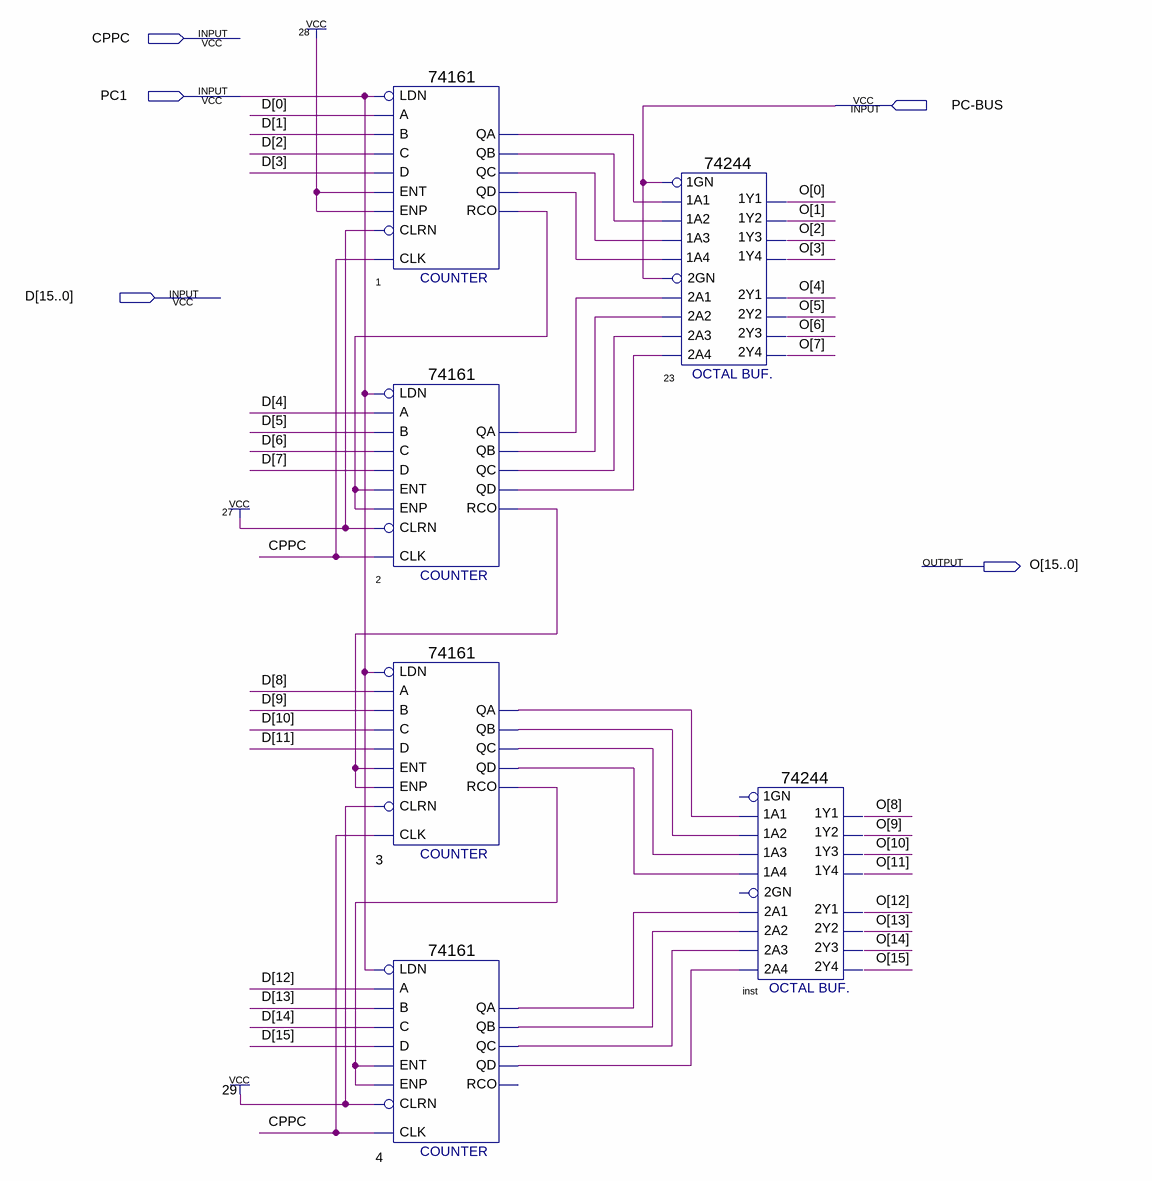
[diagram p0: schematic sheet]
// Quartus schematic 1612.bdf as structural Verilog: 6 symbols, 5 pins
module \1612  (
  input  CPPC,
  input  PC1,
  input  \PC-BUS ,
  input  [15:0] D,
  output [15:0] O
);

  wire n1_qa, n1_qb, n1_qc, n1_qd, n1_rco, n2_qa, n2_qb, n2_qc, n2_qd, n2_rco, n3_qa, n3_qb, n3_qc, n3_qd,
       n3_rco, n4_qa, n4_qb, n4_qc, n4_qd;

  \74161  u_1 (
    .LDN(PC1), .A(D[0]), .ENT(1'b1), .D(D[3]), .C(D[2]), .B(D[1]), .CLRN(1'b1), .CLK(CPPC), .ENP(1'b1),
    .QD(n1_qd), .QC(n1_qc), .QB(n1_qb), .QA(n1_qa), .RCO(n1_rco));
  \74161  u_2 (
    .LDN(PC1), .A(D[4]), .ENT(n1_rco), .D(D[7]), .C(D[6]), .B(D[5]), .CLRN(1'b1), .CLK(CPPC), .ENP(n1_rco),
    .QD(n2_qd), .QC(n2_qc), .QB(n2_qb), .QA(n2_qa), .RCO(n2_rco));
  \74161  u_3 (
    .LDN(PC1), .A(D[8]), .ENT(n2_rco), .D(D[11]), .C(D[10]), .B(D[9]), .CLRN(1'b1), .CLK(CPPC), .ENP(n2_rco),
    .QD(n3_qd), .QC(n3_qc), .QB(n3_qb), .QA(n3_qa), .RCO(n3_rco));
  \74161  u_4 (
    .LDN(PC1), .A(D[12]), .ENT(n3_rco), .D(D[15]), .C(D[14]), .B(D[13]), .CLRN(1'b1), .CLK(CPPC),
    .ENP(n3_rco), .QD(n4_qd), .QC(n4_qc), .QB(n4_qb), .QA(n4_qa));  // open: RCO
  \74244  u_23 (
    .\1A2 (n1_qb), .\1A1 (n1_qa), .\1A4 (n1_qd), .\1A3 (n1_qc), .\1GN (\PC-BUS ), .\2A1 (n2_qa),
    .\2GN (\PC-BUS ), .\2A3 (n2_qc), .\2A2 (n2_qb), .\2A4 (n2_qd), .\1Y2 (O[1]), .\1Y1 (O[0]), .\2Y1 (O[4]),
    .\1Y4 (O[3]), .\1Y3 (O[2]), .\2Y4 (O[7]), .\2Y3 (O[6]), .\2Y2 (O[5]));
  \74244  inst (
    .\1A2 (n3_qb), .\1A4 (n3_qd), .\1A1 (n3_qa), .\1A3 (n3_qc), .\2A3 (n4_qc), .\2A1 (n4_qa), .\2A4 (n4_qd),
    .\2A2 (n4_qb), .\1Y2 (O[9]), .\1Y4 (O[11]), .\2Y1 (O[12]), .\1Y1 (O[8]), .\2Y3 (O[14]), .\2Y4 (O[15]),
    .\1Y3 (O[10]), .\2Y2 (O[13]));  // open: 1GN, 2GN
endmodule
